# Altium schematic sheet 04_Power.SchDoc
size A4
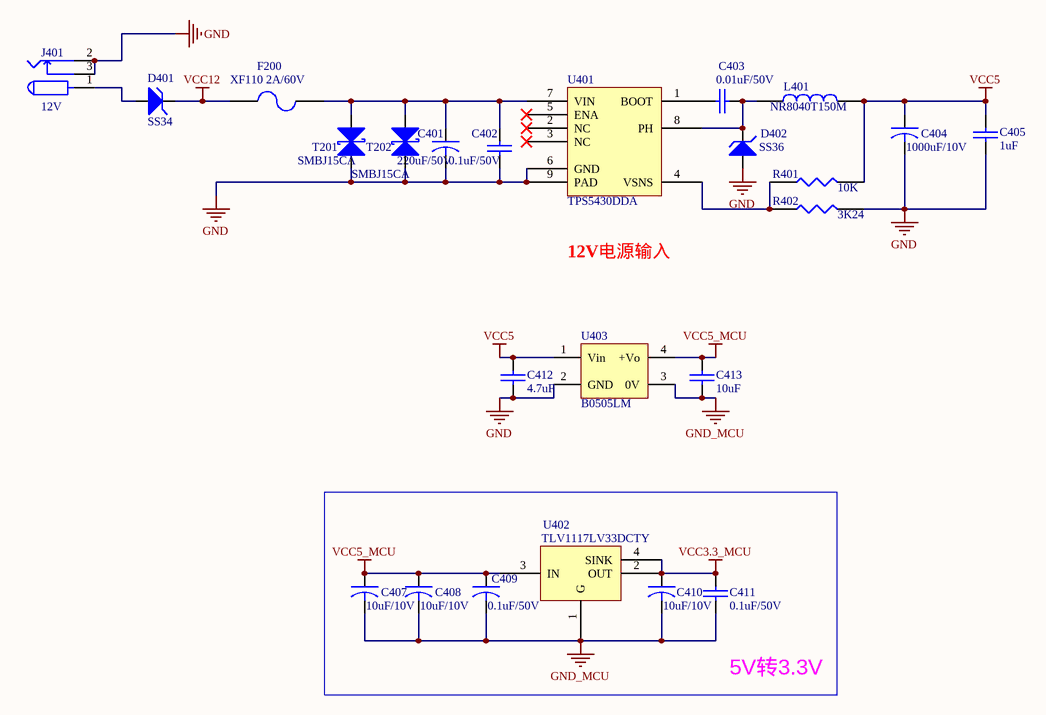
[diagram p0: 04_Power.SchDoc]

## Parts
C401  220uF/50V  [RB050-100]
C402  0.1uF/50V  [0805C]
C403  0.01uF/50V  [0603C]
C404  1000uF/10V  [RB035-080]
C405  1uF  [0603C]
C407  10uF/10V  [0805C]
C408  10uF/10V  [0603C]
C409  0.1uF/50V  [0805C]
C410  10uF/10V  [0805C]
C411  0.1uF/50V  [0603C]
C412  4.7uF  [0603C]
C413  10uF  [0603C]
D401  SS34  [D1812]
D402  SS36  [D1812]
F200  XF110 2A/60V  [FUSE1]
J401  12V  [DC10B]
L401  NR8040T150M  [NR8040]
R401  10K  [0603R]
R402  3K24  [0603R]
T201  SMBJ15CA  [SMBJ]
T202  SMBJ15CA  [SMBJ]
U401  TPS5430DDA  [SO-G8]
U402  TLV1117LV33DCTY  [SOT-233]
U403  B0505LM  [B0505LM]

## Blocks framed on the sheet
5V转3.3V: C407-C411 U402

## Nets
GND: C401.2 C402.2 C404.2 C405.1 C412.2 D402.1(A) J401.2 J401.3 R402.2 T201.2(K) T202.2(K) U401.6(GND) U401.9(PAD) U403.2(GND)
GND_MCU: C407.2 C408.2 C409.2 C410.2 C411.2 C413.1 U402.1(G) U403.3(0V)
VCC3.3_MCU: C410.1 C411.1 U402.2(OUT) U402.4(SINK)
VCC5: C404.1 C405.2 C412.1 L401.2 R401.2 U403.1(Vin)
VCC5_MCU: C407.1 C408.1 C409.1 C413.2 U402.3(IN) U403.4(+Vo)
VCC12: D401.2(K) F200.1
NetC401_1: C401.1 C402.1 F200.2 T201.1(A) T202.1(A) U401.7(VIN)
NetC403_1: C403.1 U401.1(BOOT)
NetC403_2: C403.2 D402.2(K) L401.1 U401.8(PH)
NetD401_1: D401.1(A) J401.1
NetR401_1: R401.1 R402.1 U401.4(VSNS)

Not connected (* = marked no-connect by the designer): U401 2(NC)* 3(NC)* 5(ENA)*

## Notes on the sheet
- 12V电源输入

## Library data of the parts
C401 C404 C407-C410 = CAPACITOR
C402 C403 = CAP: Capacitor
C405 C412 C413 = 0805C: Capacitor 0805
C411 = CAP
D401 = 1N5822: Zener Diode
D402 = SS36: Zener Diode
F200 = FUSE2: Fuse
J401 = POW
L401 = INDUCTOR
R401 R402 = RES1
T201 T202 = TVS
U402 = LM1117
U403 = B0505LM: DC/DC隔离电源（Mornsun）